# EAGLE board PX4FMUv1.7.1 (EAGLE 6.4)
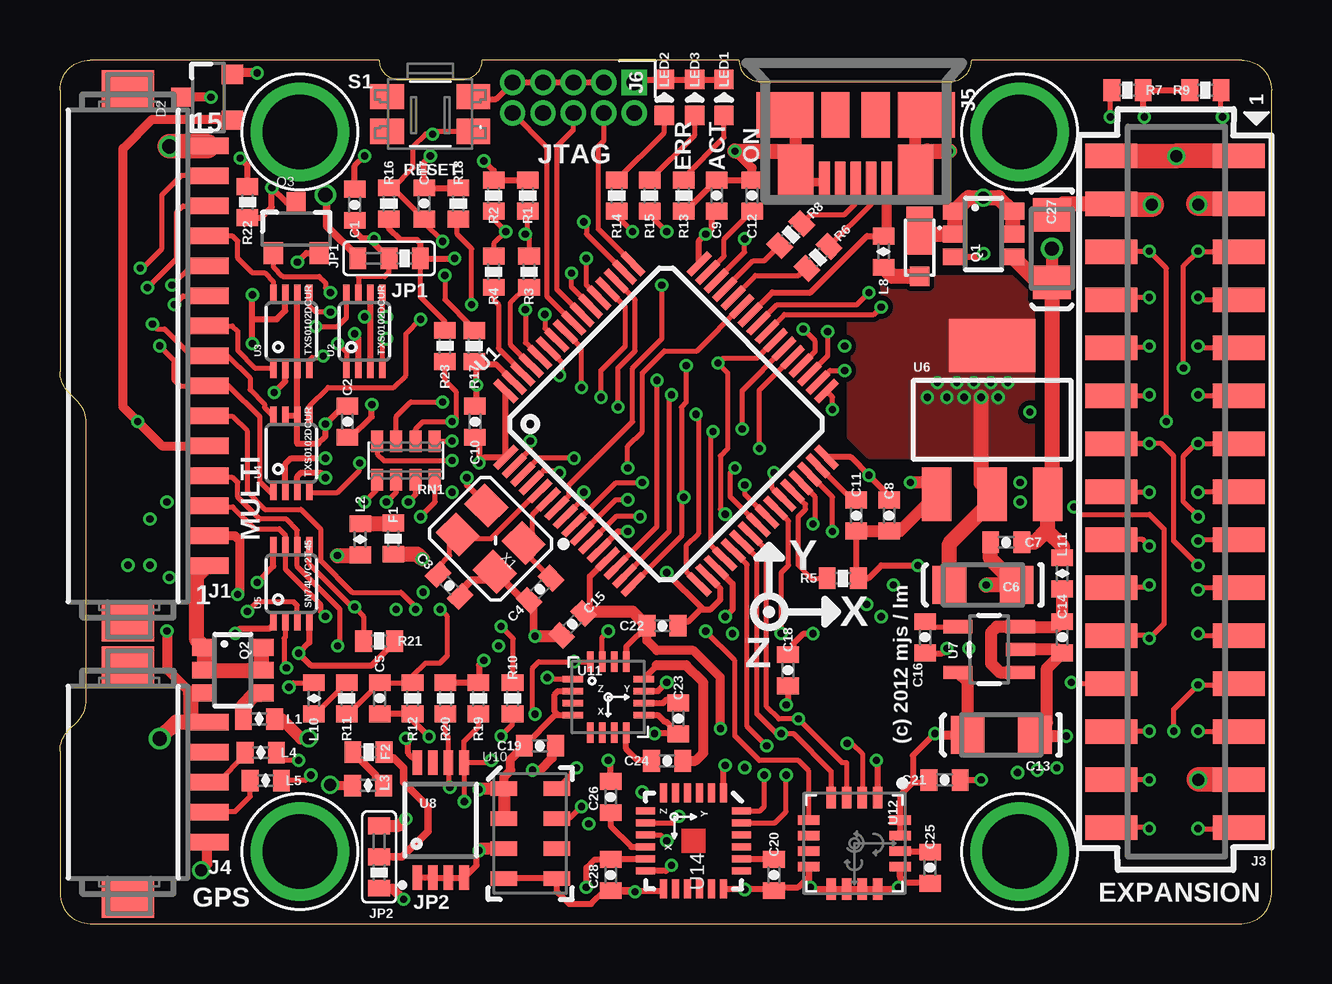
[diagram p3: board, top side]
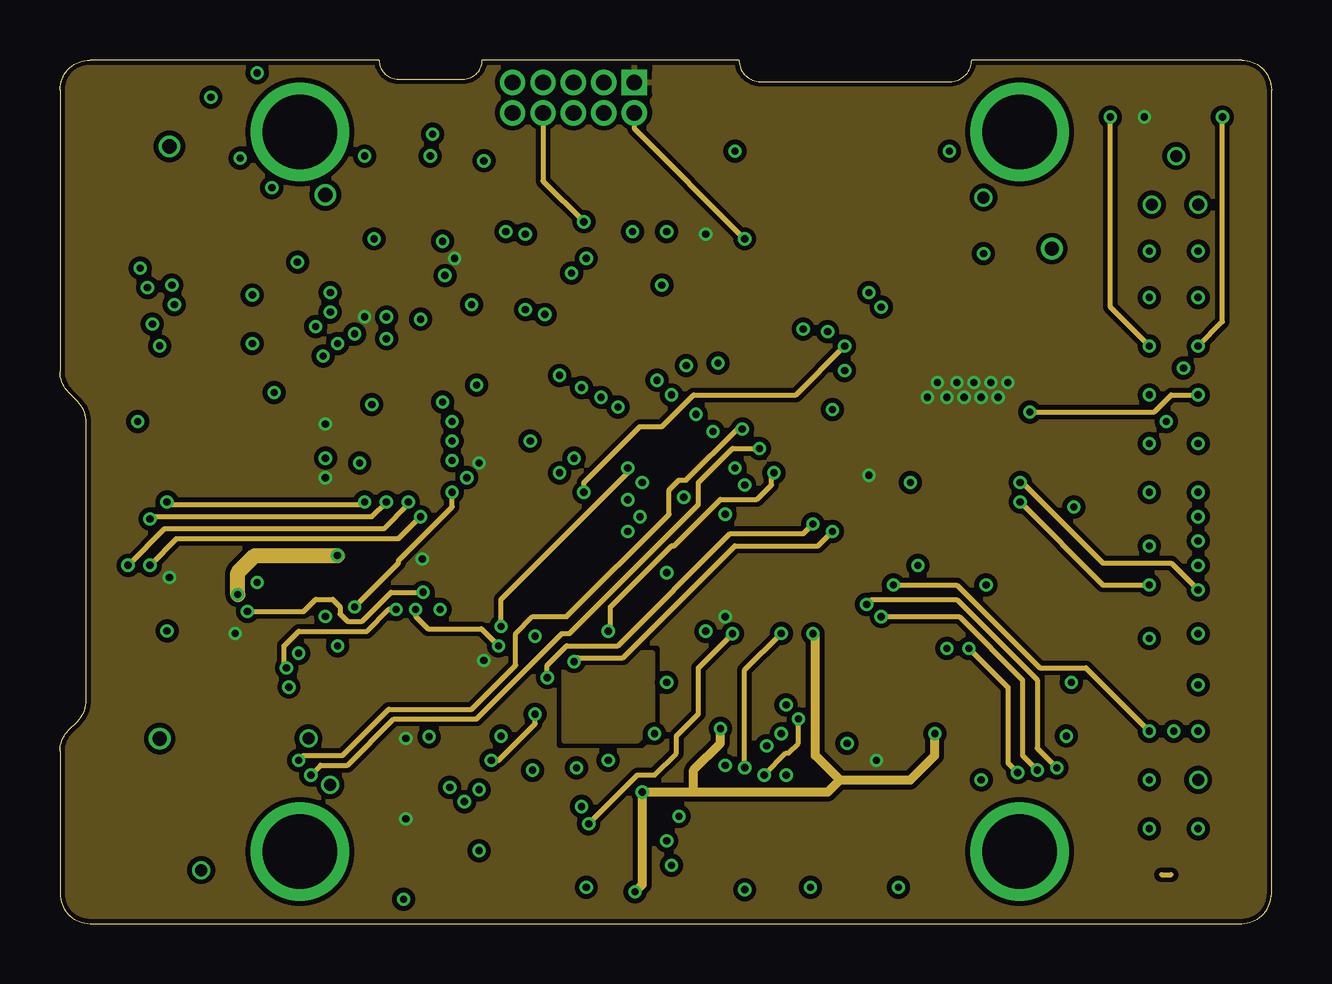
[diagram p4: board, inner layer Route2]
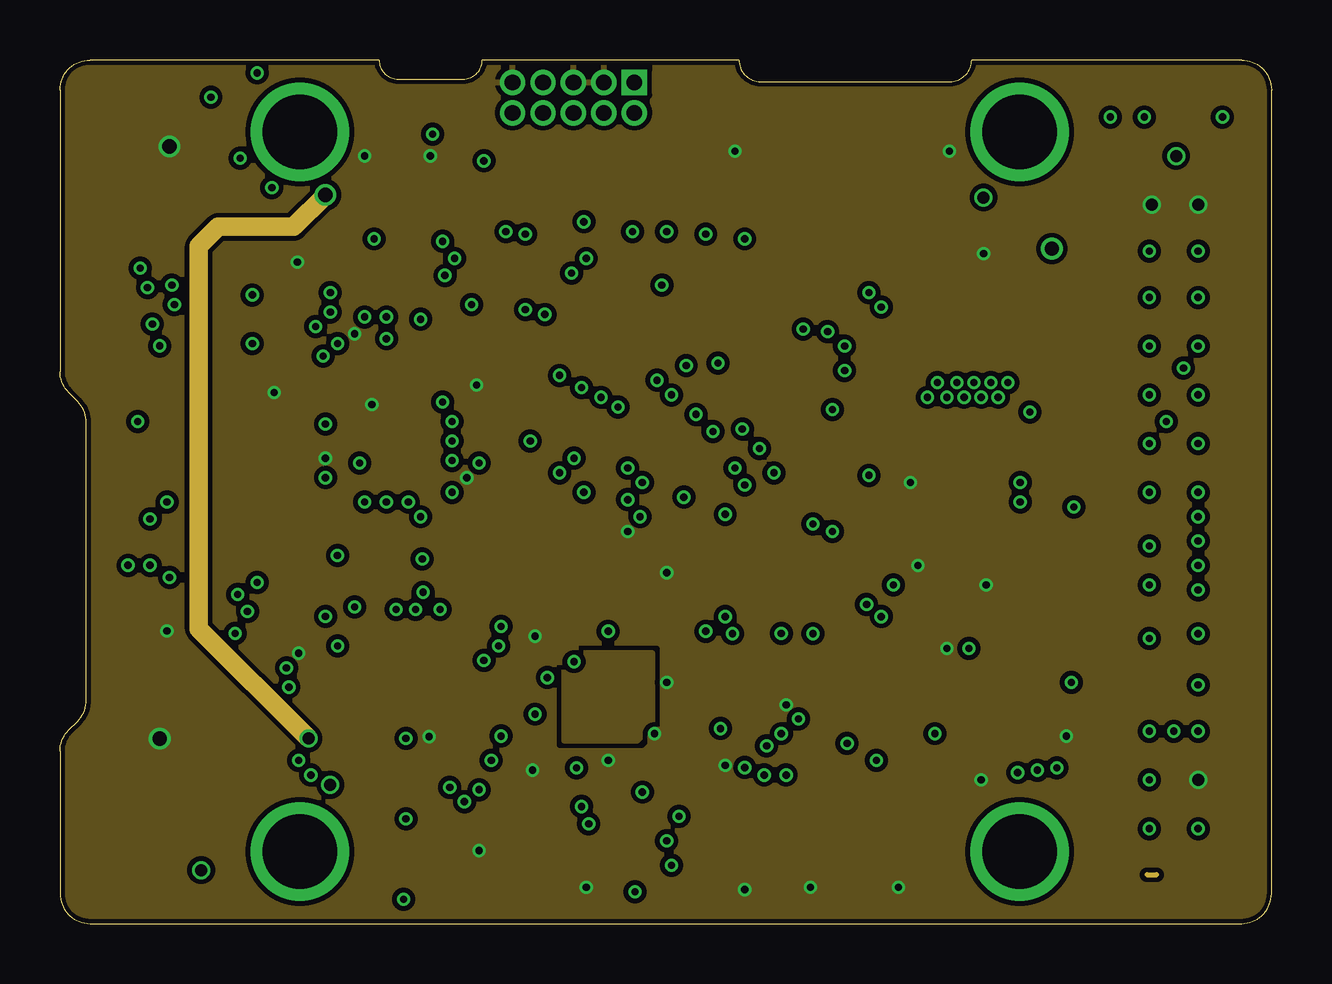
[diagram p5: board, inner layer Route15]
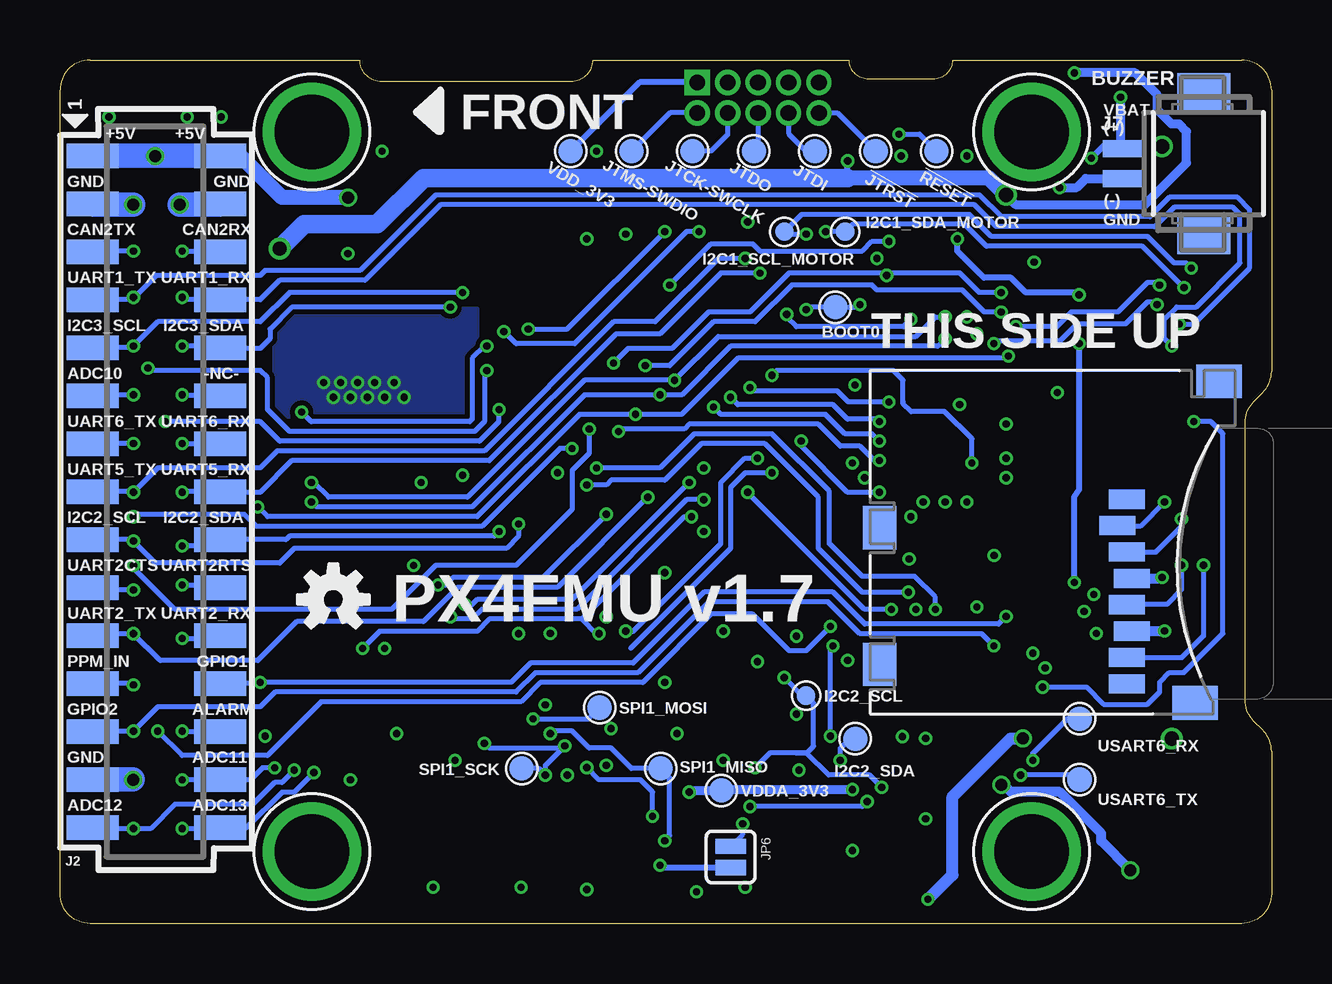
[diagram p6: board, bottom side, seen from below]

Size 50.5 x 36 mm. Coordinates in mm from the lower left corner, seen from the top.
Outline: 0,7.18 0,1.25 arc90 1.25,0 49.25,0 arc90 50.5,1.25 50.5,34.75 arc90 49.25,36 38,36 arc-90 37.1,35.1 29.2,35.1 arc-90 28.3,36 17.6,36 arc-90 16.8,35.2 14.1,35.2 arc-90 13.3,36 1.25,36 arc90 0,34.75 0,23.02 arc45 0.37,22.13 0.73,21.77 arc-45 1.1,20.88 1.1,9.32 arc-45 0.73,8.43 0.37,8.07 arc45 0,7.18
Copper layers (1*2*15*16): Top 0.035mm / dielectric 0.5mm / Route2 0.035mm / dielectric 0.5mm / Route15 0.035mm / dielectric 0.5mm / Bottom 0.035mm
Design rules "default": minimum track width 0.15mm, minimum drill 0.3mm, track to track 0.15mm, track to pad 0.15mm, pad to pad 0.15mm, via to via 0.15mm, smd to smd 0.15mm, copper to edge 0.2mm, drill to drill 0.2mm, minimum pad ring 0.125mm, minimum via ring 0.125mm, stop-mask expansion 1mil, vias tented up to drill 0.31mm, thermal gap 8mil
Net classes: 0 signal: width 0.203 mm, drill 0.3 mm, clearance 0.203 mm; 1 power: width 0.254 mm, drill 0.3 mm, clearance 0.203 mm

## Footprints (pad centres in the part's own frame; a part is rotated, then mirrored left to right if it is on the bottom)
PAD.04X.04 = smd 1.016 x 1.016: P$1 0,0
0402-CAP = smd 0.7 x 0.9: 1 -0.65,0; 2 0.65,0
EIA3216 = smd 1.4 x 1.6: A 1.4,0; C -1.4,0
MICROSMP = smd 0.8 x 0.8: ANODE 0.65,0 | smd 2 x 1.1: CATHODE -1.25,0
SOT23-3 = smd 0.8 x 0.9: 1 -0.95,-1; 2 0.95,-1; 3 0,1.1
0402-PTC = smd 0.7 x 0.9: 1 -0.65,0; 2 0.65,0
PAD.03X.03 = smd 0.762 x 0.762: P$1 0,0
DF13A-15P-1.25H = smd 0.7 x 1.8: 1 -8.75,-3.3; 2 -7.5,-3.3; 3 -6.25,-3.3; 4 -5,-3.3; 5 -3.75,-3.3; 6 -2.5,-3.3; 7 -1.25,-3.3; 8 0,-3.3; 9 1.25,-3.3; 10 2.5,-3.3; 11 3.75,-3.3; 12 5,-3.3; 13 6.25,-3.3; 14 7.5,-3.3; 15 8.75,-3.3 | smd 1.6 x 2.2: S1 11.1,0; S2 -11.1,0
HEADER_2MM_2X15_REVERSE = smd 1.02 x 2.16: 1 -14,-2.655; 2 -14,2.655; 3 -12,-2.655; 4 -12,2.655; 5 -10,-2.655; 6 -10,2.655; 7 -8,-2.655; 8 -8,2.655; 9 -6,-2.655; 10 -6,2.655; 11 -4,-2.655; 12 -4,2.655; 13 -2,-2.655; 14 -2,2.655; 15 0,-2.655; 16 0,2.655; 17 2,-2.655; 18 2,2.655; 19 4,-2.655; 20 4,2.655; 21 6,-2.655; 22 6,2.655; 23 8,-2.655; 24 8,2.655; 25 10,-2.655; 26 10,2.655; 27 12,-2.655; 28 12,2.655; 29 14,-2.655; 30 14,2.655
HEADER_2MM_2X15 = smd 1.02 x 2.16: 1 14,-2.655; 2 14,2.655; 3 12,-2.655; 4 12,2.655; 5 10,-2.655; 6 10,2.655; 7 8,-2.655; 8 8,2.655; 9 6,-2.655; 10 6,2.655; 11 4,-2.655; 12 4,2.655; 13 2,-2.655; 14 2,2.655; 15 0,-2.655; 16 0,2.655; 17 -2,-2.655; 18 -2,2.655; 19 -4,-2.655; 20 -4,2.655; 21 -6,-2.655; 22 -6,2.655; 23 -8,-2.655; 24 -8,2.655; 25 -10,-2.655; 26 -10,2.655; 27 -12,-2.655; 28 -12,2.655; 29 -14,-2.655; 30 -14,2.655
DF13A-5P-1.25H = smd 0.7 x 1.8: 1 -2.5,-3.3; 2 -1.25,-3.3; 3 0,-3.3; 4 1.25,-3.3; 5 2.5,-3.3 | smd 1.6 x 2.2: S1 4.85,0; S2 -4.85,0
MOLEX-47346-0001 = smd 1.7 x 0.44: D+ 2.8,0; D- 2.8,0.65; GND 2.8,-1.3; ID 2.8,-0.65; VBUS 2.8,1.3 | smd 1.9 x 2.375: GND1 0,2.95; GND4 0,-2.95 | smd 2.1 x 1.475: GND2 2.3,2.5; GND3 2.3,-2.5 | smd 1.9 x 1.175: GND5 0,-0.838; GND6 0,0.838
FTSH-105-01-XXX-DV = drill 0.65 pad 1.06 square: 1 0,0 | drill 0.65 pad 1.06: 2 0,1.27; 3 1.27,0; 4 1.27,1.27; 5 2.54,0; 6 2.54,1.27; 7 3.81,0; 8 3.81,1.27; 9 5.08,0; 10 5.08,1.27
DF13A-2P-1.25H = smd 0.7 x 1.8: 1 -0.605,-3.3; 2 0.645,-3.3 | smd 1.6 x 2.2: S1 2.995,0; S2 -2.955,0
SJ_3_0603_PASTE1&2 = smd 0.7 x 0.9: 1 -0.65,0; 2 0.65,0; 3 1.95,0
SJ_2 = smd 0.635 x 1.27: 1 -0.889,0; 2 0,0
0402-IND = smd 0.7 x 0.9: 1 -0.65,0; 2 0.65,0
LED-0603 = smd 0.8 x 0.8: A 0,-0.75; C 0,0.75
TSOP-6@1 = smd 0.7 x 1: 1 -0.95,-1.2; 2 0,-1.2; 3 0.95,-1.2; 4 0.95,1.2; 5 0,1.2; 6 -0.95,1.2
0402-RES = smd 0.7 x 0.9: 1 -0.65,0; 2 0.65,0
CTS742C083 = smd 0.5 x 0.9: 1 -1.2,-0.8; 2 -0.4,-0.8; 3 0.4,-0.8; 4 1.2,-0.8; 5 1.2,0.8; 6 0.4,0.8; 7 -0.4,0.8; 8 -1.2,0.8
EVQP7J01K = smd 1.4 x 1.05: A1 -1.8,0.725; A2 1.8,0.725; B3 -1.8,-0.725; B4 1.8,-0.725
TQFP64 = smd 1.2 x 0.29: 1 -5.7,3.75; 2 -5.7,3.25; 3 -5.7,2.75; 4 -5.7,2.25; 5 -5.7,1.75; 6 -5.7,1.25; 7 -5.7,0.75; 8 -5.7,0.25; 9 -5.7,-0.25; 10 -5.7,-0.75; 11 -5.7,-1.25; 12 -5.7,-1.75; 13 -5.7,-2.25; 14 -5.7,-2.75; 15 -5.7,-3.25; 16 -5.7,-3.75; 33 5.7,-3.75; 34 5.7,-3.25; 35 5.7,-2.75; 36 5.7,-2.25; 37 5.7,-1.75; 38 5.7,-1.25; 39 5.7,-0.75; 40 5.7,-0.25; 41 5.7,0.25; 42 5.7,0.75; 43 5.7,1.25; 44 5.7,1.75; 45 5.7,2.25; 46 5.7,2.75; 47 5.7,3.25; 48 5.7,3.75 | smd 0.29 x 1.2: 17 -3.75,-5.7; 18 -3.25,-5.7; 19 -2.75,-5.7; 20 -2.25,-5.7; 21 -1.75,-5.7; 22 -1.25,-5.7; 23 -0.75,-5.7; 24 -0.25,-5.7; 25 0.25,-5.7; 26 0.75,-5.7; 27 1.25,-5.7; 28 1.75,-5.7; 29 2.25,-5.7; 30 2.75,-5.7; 31 3.25,-5.7; 32 3.75,-5.7; 49 3.75,5.7; 50 3.25,5.7; 51 2.75,5.7; 52 2.25,5.7; 53 1.75,5.7; 54 1.25,5.7; 55 0.75,5.7; 56 0.25,5.7; 57 -0.25,5.7; 58 -0.75,5.7; 59 -1.25,5.7; 60 -1.75,5.7; 61 -2.25,5.7; 62 -2.75,5.7; 63 -3.25,5.7; 64 -3.75,5.7
TI-DCU = smd 0.27 x 0.8: 1 -0.75,-1.55; 2 -0.25,-1.55; 3 0.25,-1.55; 4 0.75,-1.55; 5 0.75,1.55; 6 0.25,1.55; 7 -0.25,1.55; 8 -0.75,1.55
SOT-223 = smd 1.219 x 2.235: 1 -2.311,-3.099; 2 0,-3.099; 3 2.311,-3.099 | smd 3.6 x 2.2: 4 0,3.099
SOT23-5 = smd 0.55 x 1.2: 1 -0.95,-1.3; 2 0,-1.3; 3 0.95,-1.3; 4 0.95,1.3; 5 -0.95,1.3
MSOP-8 = smd 0.4 x 1.02: 1 -0.975,-2.4; 2 -0.325,-2.4; 3 0.325,-2.4; 4 0.975,-2.4; 5 0.975,2.4; 6 0.325,2.4; 7 -0.325,2.4; 8 -0.975,2.4
MS5611-01BA = smd 1.1 x 0.6: 1 -1.1,1.875; 2 -1.1,0.625; 3 -1.1,-0.625; 4 -1.1,-1.875; 5 1.1,-1.875; 6 1.1,-0.625; 7 1.1,0.625; 8 1.1,1.875
HMC5883L-MAN = smd 0.85 x 0.285: 1 -1.475,0.75; 2 -1.475,0.25; 3 -1.475,-0.25; 4 -1.475,-0.75; 9 1.475,-0.75; 10 1.475,-0.25; 11 1.475,0.25; 12 1.475,0.75 | smd 0.285 x 0.85: 5 -0.75,-1.475; 6 -0.25,-1.475; 7 0.25,-1.475; 8 0.75,-1.475; 13 0.75,1.475; 14 0.25,1.475; 15 -0.25,1.475; 16 -0.75,1.475
L3G4200DH-MAN = smd 0.9 x 0.4: 1 -1.9,0.975; 2 -1.9,0.325; 3 -1.9,-0.325; 4 -1.9,-0.975; 9 1.9,-0.975; 10 1.9,-0.325; 11 1.9,0.325; 12 1.9,0.975 | smd 0.4 x 0.9: 5 -0.975,-1.9; 6 -0.325,-1.9; 7 0.325,-1.9; 8 0.975,-1.9; 13 0.975,1.9; 14 0.325,1.9; 15 -0.325,1.9; 16 -0.975,1.9
QFN-24 = smd 0.8 x 0.29: 1 -2,1.25; 2 -2,0.75; 3 -2,0.25; 4 -2,-0.25; 5 -2,-0.75; 6 -2,-1.25; 13 2,-1.25; 14 2,-0.75; 15 2,-0.25; 16 2,0.25; 17 2,0.75; 18 2,1.25 | smd 0.29 x 0.8: 7 -1.25,-2; 8 -0.75,-2; 9 -0.25,-2; 10 0.25,-2; 11 0.75,-2; 12 1.25,-2; 19 1.25,2; 20 0.75,2; 21 0.25,2; 22 -0.25,2; 23 -0.75,2; 24 -1.25,2
MOUNT-HOLE3.1 = drill 3.1 pad 4.1: P$1 0,0
MICROSD = smd 0.8 x 1.5: 1 -1.94,2.7; 2 -0.84,2.3; 3 0.26,2.7; 4 1.36,2.9; 5 2.46,2.7; 6 3.56,2.9; 7 4.66,2.7; 8 5.76,2.7 | smd 1.4 x 1.9: NC -6.85,6.55; NC3 6.55,5.55 | smd 1.8 x 1.4: NC1 -0.75,-7.6; NC2 4.95,-7.6
OSCILLATOR-3.2X2.5 = smd 1.4 x 1.2: 1 -1.1,-0.85; 2 1.1,-0.85; 3 1.1,0.85; 4 -1.1,0.85

## Placement (x,y rotation side)
!JTRST  PAD.04  [PAD.04X.04]  16.5,32.2 315 bottom
!RESET  PAD.04  [PAD.04X.04]  13.96,32.2 315 bottom
BOOT0  PAD.04  [PAD.04X.04]  18.18,25.7 0 bottom
C1  0u1  [0402-CAP]  12.29,29.96 90 top
C2  0u1  [0402-CAP]  11.98,20.92 270 top
C3  8p  [0402-CAP]  16.22,14.09 315 top
C4  8p  [0402-CAP]  20.01,13.93 45 top
C5  0u1  [0402-CAP]  13.33,9.39 270 top
C6  10u  [EIA3216]  38.47,14.11 180 top
C7  0u1  [0402-CAP]  39.44,15.89 180 top
C8  0u1  [0402-CAP]  34.56,17.01 270 top
C9  0u1  [0402-CAP]  27.37,30.34 90 top
C10  0u1  [0402-CAP]  17.3,20.92 90 top
C11  2u2  [0402-CAP]  33.19,17.01 270 top
C12  2u2  [0402-CAP]  28.85,30.34 90 top
C13  10u  [EIA3216]  39.23,7.87 180 top
C14  0u1  [0402-CAP]  41.77,11.93 270 top
C15  0u1  [0402-CAP]  21.36,12.47 225 top
C16  470p  [0402-CAP]  36.06,11.93 270 top
C17  0u1  [0402-CAP]  15.18,30.01 270 top
C18  0u1  [0402-CAP]  30.34,10.56 270 top
C19  0u1  [0402-CAP]  20.01,7.41 0 top
C20  0u01  [0402-CAP]  29.76,2.02 270 top
C21  0u1  [0402-CAP]  36.87,5.99 0 top
C22  0u1  [0402-CAP]  25.11,12.41 0 top
C23  4u7  [0402-CAP]  25.77,8.55 270 top
C24  0u22  [0402-CAP]  25.31,6.78 0 top
C25  0u01  [0402-CAP]  36.26,2.33 270 top
C26  2u2  [0402-CAP]  22.95,5.28 90 top
C27  10u  [EIA3216]  41.34,28.14 270 top
C28  2u2  [0402-CAP]  22.95,2.02 90 top
D1  MSS1P4-M3  [MICROSMP]  35.83,27.63 270 top
D2  BAT54C  [SOT23-3]  6.19,34.44 90 top
F1  500mA  [0402-PTC]  13.89,16.04 90 top
F2  200mA  [0402-PTC]  12.86,7.14 180 top
I2C1_SCL_MOTOR  PAD.03  [PAD.03X.03]  20.31,28.84 0 bottom
I2C1_SDA_MOTOR  PAD.03  [PAD.03X.03]  17.77,28.84 0 bottom
I2C2_SCL  PAD.03  [PAD.03X.03]  19.4,9.5 0 bottom
I2C2_SDA  PAD.04  [PAD.04X.04]  17.35,7.7 0 bottom
J1  DF13-15P-1.25H  [DF13A-15P-1.25H]  2.84,23.66 90 top
J2  HEADER_2X15-REV  [HEADER_2MM_2X15_REVERSE]  46.47,18.01 270 bottom
J3  HEADER_2X15  [HEADER_2MM_2X15]  46.47,18.01 90 top
J4  DF13-5P-1.25H  [DF13A-5P-1.25H]  2.84,5.89 90 top
J5  47346-0001  [MOLEX-47346-0001]  33.16,33.72 270 top
J6  ARM_MINI_JTAG-TH  [FTSH-105-01-XXX-DV]  23.94,35.07 180 top
J7  DF13-2P-1.25H  [DF13A-2P-1.25H]  2.83,31.7 270 bottom
JP1  0R  [SJ_3_0603_PASTE1&2]  14.37,27.73 180 top
JP2  0R  [SJ_3_0603_PASTE1&2]  13.3,2.13 90 top
JP6  JUMPER-2  [SJ_2]  22.55,2.33 270 bottom
JTCK-SWCLK  PAD.04  [PAD.04X.04]  24.13,32.2 315 bottom
JTDI  PAD.04  [PAD.04X.04]  19.04,32.2 315 bottom
JTDO  PAD.04  [PAD.04X.04]  21.58,32.2 315 bottom
JTMS-SWDIO  PAD.04  [PAD.04X.04]  26.67,32.2 315 bottom
L1  FERRITE  [0402-IND]  8.3,8.53 180 top
L2  FERRITE  [0402-IND]  12.51,16.02 270 top
L3  FERRITE  [0402-IND]  12.84,5.76 180 top
L4  BLM15HD102SN1  [0402-IND]  8.37,7.13 180 top
L5  BLM15HD102SN1  [0402-IND]  8.58,5.96 180 top
L8  FERRITE  [0402-IND]  34.33,28.01 90 top
L10  BLM15HD102SN1  [0402-IND]  10.58,9.39 90 top
L11  FERRITE  [0402-IND]  41.77,14.6 270 top
LED1  GREEN  [LED-0603]  27.68,34.43 180 top
LED2  AMBER  [LED-0603]  25.19,34.43 180 top
LED3  BLUE  [LED-0603]  26.46,34.43 180 top
Q1  NTGS4111P  [TSOP-6@1]  38.5,28.74 270 top
Q2  NTGS4111P  [TSOP-6@1]  7.21,10.56 270 top
Q3  ZXMS6004FFTA  [SOT23-3]  9.85,28.95 0 top
R1  1K5  [0402-RES]  19.5,30.34 90 top
R2  1K5  [0402-RES]  18.08,30.34 90 top
R3  100  [0402-RES]  19.55,27.17 90 top
R4  100  [0402-RES]  18.08,27.17 90 top
R5  10K  [0402-RES]  32.63,14.39 0 top
R6  22R  [0402-RES]  31.6,27.77 225 top
R7  1K5  [0402-RES]  44.49,34.74 0 top
R8  22R  [0402-RES]  30.46,28.72 225 top
R9  1K5  [0402-RES]  47.74,34.74 180 top
R10  1K0  [0402-RES]  18.86,9.39 270 top
R11  47K/0.1%  [0402-RES]  11.96,9.39 90 top
R12  10K/0.1%  [0402-RES]  14.7,9.39 90 top
R13  270R  [0402-RES]  26,30.34 90 top
R14  270R  [0402-RES]  23.21,30.34 90 top
R15  82R  [0402-RES]  24.58,30.34 90 top
R16  10K  [0402-RES]  13.71,30.01 270 top
R17  10K  [0402-RES]  17.26,24.07 90 top
R18  10K  [0402-RES]  16.6,30.01 270 top
R19  1K5  [0402-RES]  17.44,9.39 90 top
R20  1K5  [0402-RES]  16.07,9.39 90 top
R21  10K  [0402-RES]  13.3,11.78 180 top
R22  10K  [0402-RES]  7.82,30.07 90 top
R23  10K  [0402-RES]  16.04,24.08 90 top
RN1  CTS742C083  [CTS742C083]  14.42,19.3 180 top
S1  RESET  [EVQP7J01K]  15.44,33.75 180 top
SPI1_MISO  PAD.04  [PAD.04X.04]  25.47,6.46 315 bottom
SPI1_MOSI  PAD.04  [PAD.04X.04]  28.01,9 0 bottom
SPI1_SCK  PAD.04  [PAD.04X.04]  31.26,6.46 315 bottom
U1  STM32F405RGT6  [TQFP64]  25.27,20.82 45 top
U2  TXS0102DCUR  [TI-DCU]  12.69,24.68 0 top
U3  TXS0102DCUR  [TI-DCU]  9.64,24.68 0 top
U4  TXS0102DCUR  [TI-DCU]  9.64,19.6 0 top
U5  SN74LVC2T45  [TI-DCU]  9.64,14.17 0 top
U6  LD1117AS33  [SOT-223]  38.85,21 0 top
U7  MIC5207  [SOT23-5]  38.73,11.42 90 top
U8  128KBit EEPROM  [MSOP-8]  15.87,4.31 0 top
U10  MS5611-01BA  [MS5611-01BA]  19.6,3.75 0 top
U11  HMC5883L  [HMC5883L-MAN]  22.85,9.44 0 top
U12  L3GD20  [L3G4200DH-MAN]  33.11,3.34 270 top
U14  MPU-6000  [QFN-24]  26.41,3.45 270 top
U$1  MOUNT-HOLE3.1MM  [MOUNT-HOLE3.1]  40,3 0 top
U$2  MOUNT-HOLE3.1MM  [MOUNT-HOLE3.1]  10,33 0 top
U$3  MOUNT-HOLE3.1MM  [MOUNT-HOLE3.1]  10,3 0 top
U$4  MOUNT-HOLE3.1MM  [MOUNT-HOLE3.1]  40,33 0 top
U$5  SF-MICROSD  [MICROSD]  8.73,15.75 270 bottom
U$7  OSHW-LOGOS  [OSHW-LOGO-S]  39.11,13.5 0 bottom
USART6_RX  PAD.04  [PAD.04X.04]  8,8.54 0 bottom
USART6_TX  PAD.04  [PAD.04X.04]  8,6 0 bottom
VDD_3V3  PAD.04  [PAD.04X.04]  29.21,32.2 315 bottom
VDDA_3V3  PAD.04  [PAD.04X.04]  22.93,5.55 0 bottom
X1  24 MHz 3.2x2.5mm 8-10pf  [OSCILLATOR-3.2X2.5]  17.95,16.04 135 top

## Tracks (layer width: path | path; a pad name or v marks a point on that pad's centre or on a via)
!JTRST
  Top 0.203: U1.56 20.31,26.13 20.31,32.35 J6.10
  Bottom 0.203: !JTRST.P$1 18.1,33.8 J6.10
ACCEL_CS  (via drill 0.3)
  Top 0.203: U1.4 20.15,18.89 20.72,18.89 v20.82,18.79
  Bottom 0.203: v20.82,18.79 21.94,18.79 22.55,18.18 22.55,15.64 26.71,11.47
ADC123_IN10  (via drill 0.3)
  Top 0.203: v21.84,17.98 21.84,17.74 U1.8 | R11.1 12.03,8.74 C5.1 R12.2 14.72,10.06 14.72,10.36 15.23,10.86 15.84,10.86 16.15,11.17 16.15,12.79 v15.84,13.1 | J3.11 47.47,22.01 v47.44,22.04
  Route2 0.203: v21.84,17.98 21.84,18.38 24.17,20.72 25.09,20.72 26.41,22.04 30.68,22.04 v32.71,24.07 | v40.43,21.33 45.61,21.33 46.32,22.04 v47.44,22.04
  Bottom 0.203: v15.84,13.1 16.96,13.1 v21.84,17.98 | v47.44,22.04 49.1,22.04 J3.11 | v32.71,24.07 32.81,24.07 33.32,23.56 33.32,21.02 33.42,20.92 40.02,20.92 v40.43,21.33
ADC123_IN11  (via drill 0.3, 0.3 pad 0.51)
  Top 0.203: v24.27,18.38 23.18,18.38 U1.9 | J2.28 43.8,5.99 v45.41,5.99
  Route2 0.203: v33.62,13.3 33.83,13.51 37.38,13.51 40.73,10.15 40.73,7.31 v41.55,6.49
  Bottom 0.203: v24.27,18.38 29.15,13.51 33.11,13.51 33.32,13.3 v33.62,13.3 | 43.8,5.99 v45.41,5.99 | v41.55,6.49 42.05,6.49 42.56,5.99 43.8,5.99 | 43.8,5.99 J2.28
ADC123_IN12  (via drill 0.3, 0.3 pad 0.51)
  Top 0.203: v23.66,17.67 23.18,17.67 U1.10 | J2.29 49.08,3.95 v47.44,3.95
  Route2 0.203: v40.73,6.39 40.12,7 40.12,10.15 37.48,12.79 v34.23,12.79
  Bottom 0.203: v23.66,17.67 24.38,17.67 28.95,13.1 32.91,13.1 33.32,12.69 34.13,12.69 v34.23,12.79 | J2.29 49.08,3.95 v47.44,3.95 46.73,3.95 45.71,4.97 42.46,4.97 41.55,5.88 41.24,5.88 v40.73,6.39
ADC123_IN13  (via drill 0.3, 0.3 pad 0.51)
  Top 0.203: v24.17,16.96 23.17,16.96 U1.11 | J2.30 45.35,4.01 v45.41,3.95
  Route2 0.203: v37.89,11.47 39.51,9.85 39.51,6.7 v39.92,6.29 | v28.03,12.08 26.61,10.66 26.61,8.73 25.7,7.82 25.7,7.1 24.78,6.19 24.07,6.19 v22.04,4.16
  Bottom 0.203: v24.17,16.96 24.48,16.96 28.75,12.69 | 28.75,12.69 32.61,12.69 33.11,12.18 37.18,12.18 v37.89,11.47 | J2.30 43.77,3.95 | v45.41,3.95 43.87,3.95 J2.30 | J2.30 42.71,4.01 41.24,5.48 40.73,5.48 v39.92,6.29 | v28.03,12.08 28.14,12.08 28.75,12.69 | v22.04,4.16 22.04,3.73 JP6.1
ALARM  (via drill 0.3)
  Top 0.203: U1.39 29.81,24.32 29.05,23.56 27.63,23.56 v27.42,23.36 27.83,22.95 27.83,19.8 27.53,19.5 27.53,17.26 v27.73,17.06 | v45.41,8.02 J2.26 | R17.2 17.26,24.89 17.16,24.89 16.05,26.01 v16.05,27.02 | Q3.1 8.9,27.37 9.29,26.98 10.81,26.98 11.07,26.72 11.07,26.51 v11.27,26.31
  Route2 0.203: v34.74,14.11 37.38,14.11 40.84,10.66 42.77,10.66 v45.41,8.02
  Bottom 0.203: J2.26 45.4,8.01 v45.41,8.02 | v27.73,17.06 30.37,14.42 34.13,14.42 34.43,14.11 v34.74,14.11 | v27.42,23.36 26.81,23.97 24.99,23.97 23.46,25.49 21.73,25.49 20.11,27.12 16.05,27.12 | 16.05,27.12 13,27.12 12.18,26.31 v11.27,26.31 | 16.05,27.12 v16.05,27.02
BOOT0  (via drill 0.3)
  Top 0.203: v19.4,25.59 19.4,24.21 U1.60 | v17.16,25.8 17.16,28.14 16.55,28.75 16.55,29.31 R18.2
  Bottom 0.203: v19.4,25.59 19.3,25.7 BOOT0.P$1 17.26,25.7 v17.16,25.8
CAN2_RX  (via drill 0.3)
  Top 0.203: J2.6 45.38,28.01 v45.41,28.03 46.12,27.32 v46.12,20.92 | U1.33 32.2,21.95 v32.2,21.43
  Bottom 0.203: J2.6 43.84,28.03 v45.41,28.03 | v32.2,21.43 32.2,20.92 33.01,20.11 41.34,20.11 42.16,20.92 v46.12,20.92
CAN2_TX  (via drill 0.3)
  Top 0.203: J2.5 47.47,28.01 v47.44,28.03 46.83,27.42 v46.83,23.16 | v32.71,23.05 32.1,23.05 U1.34
  Bottom 0.203: J2.5 49.1,28.03 v47.44,28.03 | v46.83,23.16 46.73,23.05 42.16,23.05 41.85,22.75 41.85,21.43 40.94,20.52 33.22,20.52 32.81,20.92 32.81,22.95 v32.71,23.05
GND  (via drill 0.3, 0.5, 0.6)
  Top 0.254: C14.2 41.63,11.42 | C12.2 C9.2 26.1,29.73 26.03,29.73 | C5.2 R12.1 14.7,8.48 v15.38,7.79 | U8.1 U8.2 U8.3 U8.4 17.37,2.43 17.37,2.94 v17.47,3.04 | J6.3 J6.5 J6.9 18.17,34.37 17.34,34.37 S1.B3 | C11.2 33.19,14.48 R5.2 33.7,14.39 34.23,14.93 v35.76,14.93 | U1.18 27.53,13.96 27.53,13.51 27.12,13.1 26.81,13.1 | 41.14,8.37 C13.C 40.69,7.82 | v23.66,16.35 23.27,16.35 U1.12 | 30.78,32.2 30.68,32.2 30.66,32.19 J5.GND3 | v36.97,11.47 36.77,11.27 C16.2 | J2.4 43.86,29.96 | v47.44,29.96 47.44,30.01 | U6.1 36.06,18.38 | 26.03,29.73 25.9,29.73 | R13.1 26.03,29.73 | v47.44,5.99 47.46,6.01 | 25.76,7.92 25.25,8.43 25.19,8.43 24.92,8.69 U11.9 24.31,8.7 | 25.76,12.35 C22.2 25.95,12.6 26.2,12.6 26.7,13.1 26.81,13.1 | U5.4 10.39,11.71 v9.95,11.27 10.46,10.76 13,10.76 13.95,11.72 R21.1 | C27.C 41.82,30.01 | Q1.3 38.36,27.8 v38.5,27.93 | U3.2 9.39,22.6 v8.93,22.14 | U4.2 9.39,19.16 9.64,19.41 11.06,19.41 v11.07,19.4 | C10.2 17.37,21.5 v17.37,22.45 17.37,23.32 | 17.77,17.47 16.96,18.28 v16.96,18.59 | C2.2 12.14,20.27 13,21.12 v13,21.63 | U2.2 12.44,24.42 v12.29,24.58 | C1.2 12.29,31.59 v12.69,32 | R18.1 C17.1 15.18,31.74 v15.44,32 | 17.37,23.32 R17.1 | 17.37,23.32 18.17,23.32 U1.63 | U14.11 22.93,2.7 C28.2 22.28,2.67 21.94,2.33 v21.94,1.52 | 29.83,1.45 C20.2 | 29.83,1.45 29.9,1.52 30.78,1.52 31.21,1.95 U12.8 31.21,1.59 v31.29,1.52 31.36,1.45 U12.9 U12.10 U12.11 U12.12 34.87,1.45 v34.94,1.52 35.15,1.72 35.25,1.72 | 35.01,1.89 U12.13 35.01,1.95 35.25,1.72 | 35.25,1.72 36.22,1.72 C25.2 | C26.2 22.95,6.7 v22.85,6.8 | C21.2 v38.4,5.99 | U14.18 28.51,1.45 v28.54,1.41 28.57,1.45 29.83,1.45 | 26.81,13.1 v25.29,14.62 | U11.11 24.93,9.69 v25.29,10.05
  Top 0.254: 25.76,7.92 v24.78,7.92 | 25.76,7.92 C23.2 | v30.27,9.12 30.34,9.2 C18.2 30.54,10.11 | U14.1 27.66,6.53 v27.73,6.6 | Q3.2 10.27,27.95 v9.9,27.58
  Top 0.305: 19.73,13.27 19.73,12.05 v19.8,11.98 | 20.87,11.98 C15.2 | 19.73,13.27 19.52,13.27 X1.4 17.78,14.32 17.16,14.32 16.68,13.84 C3.2 | 19.73,13.27 19.73,13.29 C4.1 | X1.2 17.77,17.47
  Top 0.381: C16.2 36.2,11.42 | C19.2 20.52,7.27 20.52,6.9 20.01,6.39 v19.7,6.39 | J5.GND 31.16,30.93 J5.GND3 | 36.14,32.2 35.69,32.2 J5.GND2 | C12.2 28.85,31.5 28.64,31.7 v28.14,32.2
  Top 0.406: v4.46,12.19 4.46,10.59 5.44,9.61
  Top 0.508: 41.63,11.42 U7.2 | C11.2 C8.2 35,16.36 U6.1 | C14.2 41.14,10.64 41.14,8.37 | 40.69,7.82 v41.95,7.82 | 36.06,18.38 v35.45,18.38 | v19.8,11.98 20.87,11.98 | U10.3 17.55,3.13 v17.47,3.04 | J5.GND4 30.21,34.29 30.68,33.83 30.68,32.24 J5.GND3 | J5.GND1 36.11,34.4 35.65,33.93 35.65,32.24 J5.GND2
  Top 0.635: v28.14,32.2 30.68,32.2 | 36.14,32.2 v37.08,32.2 | C7.2 38.79,15.2 C6.C v38.6,14.11 | 41.82,30.01 J2.4 | Q2.3 5.44,9.61 5.44,8.47 5.48,8.43 | J4.5 4.84,8.39 v4.16,7.71
  Top 1.016: 43.86,29.96 v45.51,29.96 | 47.44,30.01 J2.3 | 47.46,6.01 J2.27 | J1.15 4.58,32.41 v4.56,32.4
  Bottom 0.254: 49.09,29.96 J2.3 | 43.86,29.96 J2.4 | v47.44,5.99 47.46,6.01 | v22.85,6.8 22.95,6.7
  Bottom 0.406: U$5.6 v4.47,12.19 v4.46,12.19
  Bottom 1.016: v47.44,29.96 49.09,29.96 | v45.51,29.96 43.86,29.96 | 47.46,6.01 J2.27
  pour Route15 (rank 2): -0.41,36.46 -0.41,-0.3 51.2,-0.3 51.2,36.46
GPIO1  (via drill 0.3)
  Top 0.203: U1.24 27.93,17.8 27.93,18.79 v28.14,18.99 | U5.2 9.39,11.94 9.34,11.89 9.34,10.76 v9.44,10.66
  Route2 0.203: v9.44,10.66 v9.44,10.67 9.34,10.77 9.34,11.57 9.95,12.18 12.79,12.18 13.71,13.1 v14.01,13.1
  Bottom 0.203: v28.14,18.99 25.49,18.99 24.07,20.41 20.82,20.41 18.43,18.03 18.43,15.84 17.06,14.47 14.88,14.47 14.01,13.61 v14.01,13.1
GPIO2  (via drill 0.3)
  Top 0.203: U1.25 28.54,17.9 v28.54,18.28 | U5.3 9.89,13.26 9.75,13.41 8.22,13.41 v7.82,13.01
  Route2 0.203: v15.13,13.81 13.8,13.81 12.59,12.6 11.98,12.6 11.68,12.9 11.68,13.21 11.37,13.51 10.66,13.51 10.15,13.01 v7.82,13.01
  Bottom 0.203: v28.54,18.28 v28.54,18.29 27.73,18.29 27.53,18.48 25.29,18.48 23.77,20.01 21.12,20.01 18.89,17.77 18.89,15.64 17.06,13.81 v15.13,13.81
GPIO_DIR  (via drill 0.3)
  Top 0.203: U1.2 19.6,19.75 v19.6,20.11 | U5.5 10.39,14.99 12.18,13.2 v12.29,13.2 12.65,12.79 R21.2
  Route2 0.203: v16.35,17.98 16.35,17.37 14.11,15.13 14.11,15.03 v12.29,13.2
  Bottom 0.203: v16.35,17.98 17.67,17.98 19.6,19.91 v19.6,20.11
GPIO_EXT1  (via drill 0.3)
  Top 0.203: v42.16,10.05 42.2,10.01 J2.24 | J1.3 6.18,17.37 7.21,17.37 8.13,16.45 9.14,16.45 9.39,16.19 U5.7 9.39,14.77 9.4,14.77 10.86,13.31 10.86,13.01 v11.07,12.8
  Bottom 0.203: J2.24 42.2,10.01 v42.16,10.05 42.15,10.06 31.69,10.06 30.89,10.86 26.61,10.86 23.66,13.82 18.28,13.82 16.95,12.49 11.38,12.49 v11.07,12.8
GPIO_EXT2  (via drill 0.3)
  Top 0.203: v47.44,8.02 47.45,8.01 J2.25 | v11.57,11.57 11.68,11.68 11.68,13.1 9.89,14.88 U5.6 9.89,16.4 9.44,16.86 8.33,16.86 7.41,17.78 7.41,18.39 7.21,18.59 6.21,18.59 J1.4
  Bottom 0.203: J2.25 49.12,8.02 v47.44,8.02 46.42,9.03 42.16,9.03 41.54,9.65 31.49,9.65 30.68,10.46 26.41,10.46 23.45,13.41 18.48,13.41 17.15,12.08 12.08,12.08 v11.57,11.57
GYRO_CS  (via drill 0.3)
  Top 0.203: U1.3 19.95,19.4 v21.43,19.4 | v26.92,12.18 28.14,10.96 28.14,7.82 29.15,6.8 30.78,6.8 31.21,6.36 U12.5
  Bottom 0.203: v21.43,19.4 21.94,19.4 22.95,18.38 22.95,15.84 26.61,12.18 v26.92,12.18
I2C1_SCL
  Top 0.203: U1.61 18.79,24.11 18.79,25.9 19.41,26.52 R3.1
I2C1_SCL_EXT  (via drill 0.3)
  Top 0.203: R3.2 19.55,28.59 v19.4,28.75 19.5,28.85 R1.1 | J1.14 6.11,31.19 5.07,31.19 4.26,30.38 4.26,28.14 3.45,27.33 3.35,27.33 v3.35,27.32
  Bottom 0.203: v19.4,28.75 20.22,28.75 I2C1_SCL_MOTOR.P$1 19.59,29.56 12.59,29.56 11.68,28.64 5.17,28.64 4.06,27.53 3.56,27.53 v3.35,27.32
I2C1_SDA
  Top 0.203: U1.62 19.29,22.96 18.28,23.97 18.28,25.8 18.08,26 R4.1
I2C1_SDA_EXT  (via drill 0.3)
  Top 0.203: R4.2 18.08,28.34 v18.59,28.85 18.08,29.35 R2.1 | J1.13 5.12,29.91 4.87,29.67 4.87,27.73 v3.65,26.51
  Bottom 0.203: v3.65,26.51 5.38,28.24 11.88,28.24 12.79,29.15 17.46,29.15 I2C1_SDA_MOTOR.P$1 18.57,28.84 v18.59,28.85
I2C2_SCL  (via drill 0.3)
  Top 0.203: 16.15,8.66 R20.1 16.07,7.89 16.19,7.77 U8.6 16.19,5.74 v16.25,5.68 | v31.39,16.65 31.49,16.76 31.49,17.78 U1.29 | J2.17 47.5,16.01 v47.44,15.94 | U11.1 20.38,10.19 v20.31,10.25
  Top 0.254: U10.8 20.77,5.63 21.33,6.19 21.33,6.29 v21.53,6.49
  Route2 0.203: v31.39,16.65 31.39,16.66 30.97,16.25 30.96,16.26 27.93,16.26 23.26,11.58 21.12,11.58 20.31,10.77 v20.31,10.25
  Bottom 0.203: J2.17 47.5,16.01 v47.44,15.94 46.52,15.03 41.34,15.03 40.73,15.64 31.89,15.64 31.39,16.15 v31.39,16.65 | v16.25,5.68 16.76,6.19 18.46,6.19 19.38,7.1 | 19.38,7.1 19.8,7.1 | v20.31,10.25 19.56,9.5 I2C2_SCL.P$1 19.09,9.19 19.09,7.39 19.38,7.1 | v21.53,6.49 20.91,7.11 19.39,7.11 19.38,7.1
I2C2_SDA  (via drill 0.3, 0.3 pad 0.51)
  Top 0.203: U1.30 32.2,17.77 v32.2,16.35 | v45.41,15.74 45.14,16.01 J2.18 | v19.8,8.73 19.7,8.83 19.7,10.66 19.96,10.92 v21.43,10.92 U11.16 | U8.5 17.89,6.71 v17.98,6.8 | U8.5 16.84,7.6 17.44,8.2 R19.1 | U10.7 21.23,4.38 v21.73,4.88 | v16.86,5.08 16.86,6.69 U8.5
  Route2 0.203: v17.98,6.8 18.28,6.8 19.8,8.32 v19.8,8.73 | v21.43,10.92 21.59,11.07 23.46,11.07 28.14,15.75 31.6,15.75 v32.2,16.35
  Bottom 0.203: v45.41,15.74 44.09,15.74 J2.18 41.08,16.01 40.94,16.15 32.4,16.15 v32.2,16.35 | I2C2_SDA.P$1 17.58,7.7 17.98,7.31 v17.98,6.8 | v21.73,4.88 17.06,4.88 v16.86,5.08
I2C3_SCL  (via drill 0.3)
  Top 0.203: v47.44,24.07 47.5,24.01 J2.9 | R9.1 48.39,33.68 v48.45,33.62 | U1.41 29.89,25.8 33.22,25.8 v33.72,26.31
  Route2 0.203: v48.45,33.62 48.45,25.09 v47.44,24.07
  Bottom 0.203: J2.9 47.5,24.01 v47.44,24.07 46.42,25.09 42.16,25.09 40.94,26.31 v33.72,26.31
I2C3_SDA  (via drill 0.3, 0.3 pad 0.51)
  Top 0.203: v45.41,24.07 45.34,24.01 J2.10 | R7.1 43.78,34.74 v43.78,33.62 | U1.40 30.19,25.39 33.93,25.39 v34.23,25.7
  Route2 0.203: v43.78,33.62 43.78,25.7 v45.41,24.07
  Bottom 0.203: v45.41,24.07 43.88,24.07 J2.10 43.78,23.97 42.16,23.97 41.75,24.38 41.75,24.78 40.84,25.7 v34.23,25.7
JTCK-SWCLK
  Top 0.203: U1.49 22.45,28.94 22.45,32.4 22.67,32.63 J6.4
  Bottom 0.203: JTCK-SWCLK.P$1 23.36,32.2 22.67,32.88 J6.4
JTDI  (via drill 0.3)
  Top 0.203: U1.50 21.94,28.74 21.94,29.15 v21.84,29.25
  Route2 0.203: v21.84,29.25 20.13,30.95 J6.8
  Bottom 0.203: JTDI.P$1 19.4,32.2 20.11,32.91 20.11,33.77 J6.8
JTDO
  Top 0.203: U1.55 20.72,26.43 20.72,32.4 21.4,33.09 J6.6
  Bottom 0.203: JTDO.P$1 21.4,32.37 J6.6
JTMS-SWDIO  (via drill 0.3)
  Top 0.203: U1.46 28.54,27.99 v28.54,28.54
  Route2 0.203: v28.54,28.54 23.94,33.14 J6.2
  Bottom 0.203: JTMS-SWDIO.P$1 25.07,33.8 J6.2
LED_AMBER  (via drill 0.3)
  Top 0.203: v23.87,28.85 23.21,29.51 R14.1 | U1.35 32,23.66 v32,24.68
  Bottom 0.203: v32,24.68 31.49,24.17 29.05,24.17 24.38,28.85 v23.87,28.85
LED_BLUE  (via drill 0.3)
  Top 0.203: v25.29,28.85 24.58,29.56 R15.1 | U1.36 31.49,23.86 31.49,24.27 v30.98,24.78
  Bottom 0.203: v30.98,24.78 29.35,24.78 v25.29,28.85
MAG_DRDY  (via drill 0.3)
  Top 0.203: v29.76,18.79 29.76,18.69 29.66,18.59 29.66,18.18 30.16,17.67 U1.27 | U11.15 22.6,11.93 v22.85,12.18
  Route2 0.203: v22.85,12.18 22.95,12.28 22.95,13.2 25.49,15.75 25.59,15.75 27.53,17.68 29.05,17.68 29.66,18.29 29.66,18.69 v29.76,18.79
MPU_CS  (via drill 0.3)
  Top 0.203: U14.8 25.52,4.2 v25.8,4.47 | v30.07,12.09 30.07,14.63 30.37,14.94 30.37,16.77 U1.26
  Route2 0.203: v28.54,6.5 28.54,10.57 v30.07,12.09
  Bottom 0.203: v25.8,4.47 25.8,5.49 26.31,5.99 28.03,5.99 v28.54,6.5
N$1
  Top 0.203: U1.6 20.32,17.67 19.7,17.06 19.7,16.24 X1.1 19.33,15.53 C4.2
N$2
  Top 0.203: U1.5 19.96,18.03 17.98,16.05 16.75,16.05 X1.3 16.25,15.9 16.25,15.33 15.77,14.85 C3.1
N$3  (via drill 0.3)
  Top 0.381: J1.2 7.3,16.16 7.51,15.95 7.51,13.82 v7.41,13.72
  Top 0.635: v11.57,15.34 12.49,15.34 L2.2
  Route2 0.635: v7.41,13.72 7.41,14.63 8.12,15.34 v11.57,15.34
N$4  (via drill 0.3)
  Top 0.254: R22.2 7.82,31.6 v7.51,31.9
  Top 0.381: v6.29,34.44 D2.3
  Bottom 0.254: 6.29,32.47 6.95,32.47 v7.51,31.9
  Bottom 0.381: v6.29,34.44 6.29,32.47 J7.1
N$5
  Top 0.305: F2.2 12.21,7.13 13.15,6.19 13.15,6.1 L3.1
N$8
  Top 0.203: L5.2 7.93,5.29 7.31,4.67 6.17,4.67 J4.2
N$9
  Top 0.203: U7.4 36.27,12.37 C16.1
N$10
  Top 0.254: U11.8 23.6,7.28 24.07,6.81 24.63,6.81 C24.1
N$11
  Top 0.203: J4.3 6.24,5.99 6.7,5.99 7.62,6.92 7.62,7.03 L4.2
N$12  (via drill 0.3)
  Top 0.203: J1.11 5.47,27.41 v4.67,26.61 | U2.8 11.94,25.26 11.57,24.89 10.67,24.89 v10.66,24.88
  Bottom 0.203: v4.67,26.61 4.78,26.72 5.17,26.72 6.4,25.49 8.32,25.49 8.32,25.5 8.94,24.88 v10.66,24.88
N$13  (via drill 0.3)
  Top 0.203: U2.1 11.94,23.81 v11.58,24.18 v11.57,24.18 | J1.10 5.13,26.16 v4.77,25.8
  Bottom 0.203: 8.83,24.28 8.12,24.99 6.09,24.99 5.17,25.91 4.88,25.91 v4.77,25.8 | 8.83,24.28 | 8.83,24.28 11.46,24.28 v11.57,24.18
N$14
  Top 0.635: L1.2 7.65,9.07 8.12,9.54 8.34,9.54 Q2.4
N$15
  Top 0.203: 8.89,26.34 U3.8 8.89,26.76 8.53,27.13 8.02,27.13 7.41,27.74 7.41,28.45 7.21,28.65 J1.12
N$16
  Top 0.203: U3.1 8.86,23.16 8.12,23.16 7.41,23.88 7.41,24.69 7.18,24.91 J1.9
N$17
  Top 0.254: U11.12 24.52,10.19 24.52,10.39 24.88,10.76
  Top 0.406: 24.88,10.76 26.1,10.76 26.81,10.05 26.81,7.11 26.48,6.78 C24.2
N$18
  Top 0.305: JP2.2 14.26,2.78 15.33,3.85 15.33,4.87 14.32,5.88 14.32,6.49 13.91,6.9 13.75,6.9 F2.1
N$20  (via drill 0.3)
  Top 0.203: J3.12 45.38,22.01 v45.41,22.04
  Bottom 0.203: v45.41,22.04 43.85,22.04 J3.12
N$21  (via drill 0.3)
  Top 0.203: v12.69,17.57 13.2,18.08 13.2,18.38 13.22,18.39 RN1.5
  Route2 0.203: v12.69,17.57 12.59,17.47 4.57,17.47 v4.46,17.58
  Bottom 0.203: v4.46,17.58 5.48,16.56 6.4,16.56 U$5.2
N$23
  Top 0.635: L8.1 34.71,26.98 D1.ANODE
N$24  (via drill 0.5)
  Top 0.381: L3.2 11.29,5.76 v11.27,5.78
  Top 0.406: J4.1 6.14,2.48 v5.88,2.23
  Bottom 0.406: v11.27,5.78 11.16,5.78 10.86,5.49 8.83,5.49 7.1,3.76 7.1,3.45 v5.88,2.23
N$25  (via drill 0.3)
  Top 0.254: R22.1 8.38,29.42 8.83,29.87 v8.83,30.68 9.47,30.05 Q3.3
  Bottom 0.381: v8.83,30.68 8.12,30.68 7.75,31.05 J7.2
N$26  (via drill 0.3)
  Top 0.203: v13.61,17.57 14.01,17.98 RN1.6
  Route2 0.203: v13.61,17.57 13,16.96 3.85,16.96 v3.75,16.87
  Bottom 0.203: U$5.3 4.82,15.49 3.75,16.56 v3.75,16.87
N$27
  Top 0.635: L2.1 13.87,16.67 F1.2
N$28
  Top 0.203: R15.2 26.46,32.88 LED3.C
N$29
  Top 0.203: R13.2 26,31.1 27.68,32.77 LED1.C
N$30
  Top 0.203: R14.2 25.19,32.98 LED2.C
N$31  (via drill 0.3)
  Top 0.203: v14.52,17.57 v14.52,17.58 14.83,17.88 RN1.7
  Route2 0.203: v14.52,17.57 14.52,17.47 13.51,16.45 4.35,16.45 v2.84,14.94
  Bottom 0.203: U$5.7 3.74,11.09 2.84,11.99 v2.84,14.94
N$32  (via drill 0.3)
  Top 0.203: v15.03,16.96 v15.03,16.97 15.64,17.58 15.64,18.48 RN1.8
  Route2 0.203: v15.03,16.96 14.11,16.05 4.86,16.05 v3.75,14.94
  Bottom 0.203: v3.75,14.94 3.75,13.92 4.36,13.31 6.01,13.31 U$5.5
N$34
  Top 0.254: U12.14 36.22,3.02 C25.1
N$35
  Top 0.203: L10.1 10.65,8.74 R11.2
N$36
  Top 0.254: U11.10 25.14,9.19 25.29,9.34 25.64,9.34 C23.1
N$40
  Top 0.254: U14.20 29.78,2.7 C20.1
N$41
  Top 0.635: J1.1 6.12,14.91 5.7,14.5 5.7,11.81 Q2.1 Q2.2 Q2.5 Q2.6
N$42
  Top 0.254: U14.10 23.81,3.2 22.95,4.06 C26.1
N$44  (via drill 0.3)
  Top 0.254: U14.12 25.26,2.2 v25.49,2.43
  Bottom 0.254: v25.49,2.43 25.39,2.33 JP6.2
N$100
  Top 0.254: 41.57,12.37 C14.1
  Top 0.508: C14.1 L11.2 | 41.57,12.37 U7.3 39.04,12.37 38.8,12.13 38.8,10.84 39.17,10.47 U7.1
OTG_DM
  Top 0.203: R6.1 33.81,29.99 J5.D-
OTG_DP
  Top 0.203: J5.D+ 33.16,30.02 32.71,29.56 31.3,29.56 R8.1
OTG_FS_DM
  Top 0.203: U1.44 28.99,27.02 30.78,27.02 31.07,27.31 R6.2
OTG_FS_DP
  Top 0.203: U1.45 28.89,27.63 29.35,27.63 29.99,28.26 R8.2
PB2-BOOT1
  Top 0.203: U1.28 31.08,17.48 31.08,17.26 30.78,16.96 30.78,14.93 31.31,14.39 R5.1
POLY1
  Route15 0.203: 45.31,2.03 45.71,2.03
  pour Route2 (rank 2): 21.02,11.28 24.68,11.28 24.68,8.23 24.07,7.62 21.02,7.62
POLY2
  Route2 0.203: 45.91,2.03 46.32,2.03
  pour Route15: 21.02,11.28 24.68,11.28 24.68,8.23 24.07,7.62 21.02,7.62
PPM_INPUT  (via drill 0.3)
  Top 0.203: v46.42,8.02 46.42,8.93 v47.44,9.95 49.07,9.95 J2.23 | v18.38,12.39 18.89,11.88 18.89,10.06 R10.1 | v23.66,18.99 23.66,19.91 24.27,20.52 24.27,22.95 25.19,23.87 26.55,23.87 U1.43
  Route2 0.203: v23.66,18.99 23.66,18.79 18.38,13.51 v18.38,12.39
  Bottom 0.203: v46.42,8.02 45.41,7 41.85,7 39.62,9.24 39.62,9.25 31.29,9.25 30.48,10.05 26.2,10.05 26.09,10.16 26.1,10.16 23.36,12.9 21.63,12.9 20.1,11.37 19.4,11.37 v18.38,12.39 | J2.23 47.5,10.01 v47.44,9.95
PPM_INPUT_CON  (via drill 0.3)
  Top 0.203: v14.83,13.1 14.83,13.2 14.22,13.81 12.18,13.81 10.86,15.13 10.86,16.45 10.05,17.26 8.53,17.26 7.82,17.98 7.82,20.52 7.21,21.13 6.17,21.13 J1.6 | R10.2 18.86,8.3 v18.38,7.82
  Route2 0.203: v14.83,13.1 14.83,12.79 15.33,12.29 17.57,12.29 v18.28,11.57
  Bottom 0.203: v18.38,7.82 18.38,11.47 v18.28,11.57
RESET  (via drill 0.3)
  Top 0.203: U1.7 21.23,17.84 21.23,18.28 23.87,20.92 23.87,23.16 25.09,24.38 v25.09,26.61 | 17.22,33.01 S1.A1 15.65,33.02 v15.54,32.91 15.23,32.91 14.72,32.4 14.72,31.51 13.88,30.66 | 13.88,30.66 R16.1 | 13.88,30.66 C17.2 15.18,29.2 v15.94,28.44
  Bottom 0.203: v25.09,26.61 23.36,28.34 21.63,28.34 21.33,28.03 17.06,28.03 16.65,28.44 v15.94,28.44 | !RESET.P$1 14.67,32.91 v15.54,32.91
SPI1_MISO  (via drill 0.3)
  Top 0.203: U1.22 29.05,15.27 29.05,8.73 29.86,7.92 v30.07,7.92 30.57,7.92 32.14,6.35 U12.4 | U14.9 25.04,3.7 v25.29,3.45
  Bottom 0.203: v25.29,3.45 25.09,3.66 25.09,6.08 SPI1_MISO.P$1 26.68,6.46 26.68,6.47 27.53,7.32 28.44,7.32 29.15,8.03 29.96,8.03 v30.07,7.92
SPI1_MOSI  (via drill 0.3)
  Top 0.203: U1.23 29.46,15.57 29.46,9.03 29.96,8.53 v30.78,8.53 32.59,6.72 32.79,6.72 U12.3 | U14.24 29.17,4.7 29.35,4.88 v29.35,6.19
  Route2 0.203: v29.35,6.19 v29.35,6.2 30.27,7.11 30.37,7.11 30.78,7.52 v30.78,8.53
  Bottom 0.203: v30.78,8.53 28.48,8.53 SPI1_MOSI.P$1
SPI1_SCK  (via drill 0.3)
  Top 0.203: v29.46,7.41 28.64,8.22 28.64,14.97 U1.21 | v32.81,7.51 33.02,7.51 33.44,7.09 U12.2 | U14.23 29.8,4.2 30.27,4.67 v30.27,6.19
  Bottom 0.203: v29.46,7.41 | v32.81,7.51 32.61,7.31 29.56,7.31 v29.46,7.41 | v29.46,7.41 30.27,6.6 v30.27,6.19 30.54,6.46 SPI1_SCK.P$1
SPI3_MISO  (via drill 0.3)
  Top 0.203: v22.55,21.94 22.55,23.05 23.56,24.07 23.56,25.7 U1.52 | RN1.2 14.83,20.62 15.13,20.92 v16.35,20.92 16.43,20.92 16.53,21.02 16.53,22.15 16.05,22.63 R23.1 | RN1.2 14.83,20 | RN1.2
  Bottom 0.203: v16.35,20.92 16.45,21.02 17.67,21.02 18.28,21.63 22.24,21.63 v22.55,21.94
SPI3_MOSI  (via drill 0.3)
  Top 0.203: v21.73,22.34 21.73,24 U1.57 | RN1.3 14.01,21.13 14.62,21.74 v15.94,21.74
  Bottom 0.203: v21.73,22.34 21.59,22.2 18.1,22.2 17.64,21.74 v15.94,21.74
SPI3_NSS  (via drill 0.3)
  Top 0.203: U1.20 27.12,15.78 27.12,20.31 27.22,20.41 v27.22,20.52 | v16.35,19.3 13.51,19.3 13.22,19.58 RN1.4
  Bottom 0.203: v27.22,20.52 27.12,20.62 24.48,20.62 24.27,20.82 18.89,20.82 17.98,19.91 17.16,19.91 16.55,19.3 v16.35,19.3
SPI3_SCK  (via drill 0.3)
  Top 0.203: v23.26,21.53 23.26,23.16 23.97,23.87 23.97,26 U1.51 | v16.35,20.11 15.63,20.11 RN1.1
  Bottom 0.203: v16.35,20.11 16.65,20.41 17.77,20.41 18.59,21.23 22.95,21.23 v23.26,21.53
UART5_RX  (via drill 0.3, 0.3 pad 0.51)
  Top 0.203: v45.41,17.98 43.85,17.98 J2.16 | v21.33,27.12 21.33,26.52 U1.54
  Bottom 0.203: v45.41,17.98 45.37,18.01 J2.16 43.79,17.98 42.16,17.98 40.84,19.3 32.61,19.3 27.32,24.58 25.49,24.58 22.95,27.12 v21.33,27.12
UART5_TX  (via drill 0.3)
  Top 0.203: J2.15 47.47,18.01 v47.44,17.98 | v21.94,27.73 21.94,26.62 U1.53
  Bottom 0.203: J2.15 47.47,18.01 v47.44,17.98 46.42,18.99 42.16,18.99 41.45,19.7 32.81,19.7 27.42,25.09 25.7,25.09 23.05,27.73 v21.94,27.73
USART1_RX  (via drill 0.3)
  Top 0.203: v20.82,22.85 20.92,22.95 20.92,23.4 U1.59 | v12.49,19.19 12.49,18.89 11.57,17.98 10.47,17.98 U4.4
  Bottom 0.203: v20.82,22.85 20.62,23.05 15.84,23.05 15.77,23.05 15.36,22.65 15.36,21.74 15.36,21.67 15.03,21.34 13.61,21.34 13.61,21.33 12.49,20.21 v12.49,19.19
USART1_RX_EXT  (via drill 0.3)
  Top 0.203: J2.8 43.91,26.1 v45.41,26.1 | U4.1 8.79,17.95 8.32,18.42 8.32,21.13 7.04,22.41 J1.7 5,22.41 4.77,22.65 4.77,23.47 v4.16,24.08
  Bottom 0.203: v45.41,26.1 45.31,26.01 J2.8 42.15,26.01 41.34,26.81 37.79,26.81 34.64,29.96 12.38,29.96 11.47,29.06 4.88,29.06 4.87,29.05 4.06,29.86 1.61,29.86 1.31,29.57 1.31,27.53 3.14,25.7 3.95,25.7 4.46,25.2 4.46,24.38 v4.16,24.08
USART1_TX  (via drill 0.3)
  Top 0.203: U1.58 20.21,24.81 v20.21,25.39 | v15.03,25.19 14.42,24.58 14.42,22.85 13.91,22.34 11.17,22.34 10.39,21.57 U4.5
  Bottom 0.203: v20.21,25.39 20.21,25.29 19.8,24.88 15.33,24.88 v15.03,25.19
USART1_TX_EXT  (via drill 0.3)
  Top 0.203: J2.7 47.53,26.01 v47.44,26.1 | v3.85,24.99 4.05,24.79 4.36,24.79 5.49,23.66 J1.8 7.01,23.66 7.92,22.76 7.92,22.25 8.53,21.64 8.53,21.52 U4.8
  Bottom 0.203: J2.7 47.53,26.01 v47.44,26.1 47.41,26.1 46.49,27.02 42.16,27.02 41.95,27.22 37.99,27.22 34.84,30.37 12.18,30.37 11.27,29.46 5.07,29.46 4.26,30.28 1.41,30.28 0.91,29.77 0.91,27.33 3.24,24.99 v3.85,24.99 3.86,24.99
USART2_CTS  (via drill 0.3, 0.3 pad 0.51)
  Top 0.203: U1.14 24.88,16.55 v24.88,22.65 | J2.19 47.54,14.01 v47.44,13.91 | v13.61,25.29 13.44,25.45 U2.5
  Route2 0.203: v40.02,18.38 40.12,18.38 43.48,15.03 46.32,15.03 v47.44,13.91
  Bottom 0.203: v40.02,18.38 39.92,18.38 39.31,17.77 33.52,17.77 28.64,22.65 v24.88,22.65 23.05,24.48 14.83,24.48 14.01,25.29 v13.61,25.29 | v47.44,13.91 49.03,13.91 J2.19
USART2_RTS  (via drill 0.3, 0.3 pad 0.51)
  Top 0.203: v25.49,22.04 25.39,21.94 25.39,16.35 U1.15 | J2.20 45.31,14.01 45.31,14.02 v45.41,14.11 | v13.61,24.38 13.44,24.21 U2.4
  Route2 0.203: v40.02,17.57 43.48,14.11 v45.41,14.11
  Bottom 0.203: v40.02,17.57 39.82,17.37 33.32,17.37 28.64,22.04 v25.49,22.04 24.58,22.04 22.55,24.07 13.91,24.07 v13.61,24.38 | v45.41,14.11 43.92,14.11 J2.20
USART2_RX  (via drill 0.3, 0.3 pad 0.51)
  Top 0.203: v26.51,21.23 26.61,21.12 26.61,16.25 26.1,15.74 26.1,14.68 U1.17 | J2.22 45.28,12.01 v45.41,11.88 46.02,12.49 46.02,16.45 45.41,17.06 42.56,17.06 v42.26,17.37 | U3.4 10.39,23.49 10.5,23.6 10.91,23.6 v10.97,23.66
  Bottom 0.203: J2.22 43.95,11.88 v45.41,11.88 | v42.26,17.37 41.85,16.96 33.11,16.96 28.85,21.23 v26.51,21.23 24.59,21.23 22.24,23.57 11.05,23.57 v10.97,23.66
USART2_TX  (via drill 0.3)
  Top 0.203: v26.1,23.26 26.1,21.73 25.9,21.53 25.9,17.77 | U1.16 25.9,16.15 25.9,17.77 | J2.21 47.51,12.01 v47.44,12.08 | 25.9,17.77 v26,17.77 | U3.5 10.39,25.77 10.66,25.5 11.26,25.5 v11.27,25.49
  Bottom 0.203: J2.21 49.05,12.08 v47.44,12.08 46.32,10.96 42.26,10.96 40.63,12.59 35.35,12.59 33.93,14.01 29.76,14.01 v26,17.77 | v26.1,23.26 25.09,23.26 23.26,25.09 21.53,25.09 20,26.62 16.65,26.62 16.45,26.42 12.89,26.42 11.97,25.49 v11.27,25.49
USART6_RX  (via drill 0.3)
  Top 0.203: v28.44,20.62 28.44,22.23 U1.38 | v9.95,6.8 9.33,6.8 9.33,6.83 L4.1 | v45.41,20.01 J3.14 45.91,20.01 46.42,19.5 46.42,15.94 v47.44,14.93
  Route2 0.203: v28.44,20.62 28.24,20.62 26.1,18.48 25.8,18.48 25.39,18.08 25.39,17.06 21.12,12.79 19.7,12.79 18.99,12.08 18.99,10.76 17.16,8.93 13.71,8.93 11.78,7 10.15,7 v9.95,6.8
  Bottom 0.203: USART6_RX.P$1 8.51,8.54 9.95,7.1 v9.95,6.8 | J3.14 v45.41,20.01 | v47.44,14.93 47.44,14.83 45.71,13.1 36.67,13.1 34.84,14.93 31.49,14.93 29.15,17.26 29.15,18.89 28.44,19.6 v28.44,20.62
USART6_TX  (via drill 0.3)
  Top 0.203: U1.37 29.15,22.23 v29.15,19.8 | v10.46,6.19 10.23,5.96 L5.1 | v47.44,16.96 46.83,17.57 46.83,19.5 47.34,20.01 v47.44,20.01 J2.13
  Route2 0.203: v29.15,19.8 28.03,19.8 26.61,18.38 26.61,17.47 21.23,12.09 20.92,12.09 17.36,8.53 13.91,8.53 11.98,6.6 10.86,6.6 v10.46,6.19
  Bottom 0.203: 8.01,5.99 USART6_TX.P$1 8.19,6.19 v10.46,6.19 | v47.44,16.96 47.34,17.06 42.82,17.06 42.31,16.55 32.91,16.55 29.66,19.8 v29.15,19.8 | v47.44,20.01 J2.13
VBAT_IN  (via drill 0.3)
  Top 0.203: L10.2 9.73,10.04 v9.54,9.86
  Top 0.381: D2.1 7.22,33.53 3.85,33.53 2.63,32.31 2.63,21.54 v3.24,20.93 4.26,19.91 J1.5
  Bottom 0.203: v3.24,20.93 2.53,20.93 2.02,20.42 2.02,12.09 3.65,10.46 4.26,10.46 4.67,10.06 4.67,9.65 5.17,9.14 7,9.14 7.71,9.86 v9.54,9.86
VBUS
  Top 0.254: 34.46,28.79 L8.2 33.64,28.66 31.29,26.31 29.69,26.31 U1.42
  Top 0.406: 34.46,28.79 J5.VBUS
VCAP_1
  Top 0.203: 33.09,17.59 U1.31
  Top 0.254: 33.09,17.59 33.12,17.59 C11.1
VCAP_2
  Top 0.203: U1.47 27.68,27.83 27.68,28.53 C12.1
VDD_3V3  (via drill 0.3)
  Top 0.203: R23.2 16.05,25.09 15.03,26.11 15.03,27.72 JP1.1
  Top 0.254: LED1.A LED3.A LED2.A 24.06,35.18 J6.1 | U1.19 28.03,14.16 28.03,13.1 v27.73,12.79 | U1.48 26.64,28.47 v26.92,28.75 27.17,29 27.17,29.41 27.37,29.61 C9.1 | U1.32 32.97,19.44 v33.72,18.69 34.56,17.85 C8.1 | 16.07,10.18 R20.2 R19.2 17.47,10.06 17.47,10.77 v17.66,10.96 v17.67,10.96 | U6.4 38.8,24.15 | 38.8,17.57 38.8,17.85 U6.2 | R9.2 R7.2 45.14,33.68 v45.2,33.62 | U4.6 U4.7 | U2.3 12.94,25.29 | 12.94,25.29 U2.6 | U3.6 U3.3 U4.6 | U4.6 9.89,20.01 10.76,20.01 11.07,20.31 v11.07,20.82 11.82,21.57 C2.1 | U1.64 U1.1 17.71,19.44 v17.47,19.19 17.47,20.02 17.37,20.12 17.37,20.2 C10.1 | 12.94,25.29 v12.69,25.29 | v16.45,27.73 JP1.1 15.03,28.35 14.88,28.49 14.22,28.49 13.71,29 R16.2 | U8.8 14.91,6.71 14.52,7.1 14.52,7.61 v14.42,7.71 | U4.3 9.89,18.64 10.05,18.8 10.86,18.8 11.07,18.59 v11.07,18.59 | U5.1 8.89,12.46 8.73,12.29 7.51,12.29 v7.31,12.09 | U12.1 34.09,6.74 v34.03,6.8
  Top 0.508: JP2.3 14.13,4.08 v14.42,4.37
  Top 0.635: U6.2 38.4,18.36 v38.4,21.94 | C6.A 37.07,15.84 38.8,17.57 | F1.1 14.91,15.39 v15.1,15.2
  Bottom 0.254: VDD_3V3.P$1 26.34,35.07 J6.1
  Bottom 0.406: U$5.4 4.6,14.39 v4.56,14.43
  other vias: 38.8,22.55 39.51,22.55 39.11,21.94 38.09,22.55 37.69,21.94 37.38,22.55 36.97,21.94 36.16,21.94 36.57,22.55
  pour Route2 (rank 3): -0.41,36.46 -0.41,-0.3 51.2,-0.3 51.2,36.46
  pour Top (no thermals): 40.53,26.92 32.91,26.92 32.91,20.31 33.72,19.5 40.53,19.5
  pour Bottom: 33.11,20.62 33.11,25.6 41.55,25.6 41.55,20.62
VDD_3V3_ANALOG  (via drill 0.3)
  Top 0.254: U1.13 22.82,15.2 22.09,14.47 22.09,13.2 C15.1 21.89,12.93 21.96,13 | 20.62,8.84 20.62,9.55 20.76,9.69 U11.2 | 35.55,5.88 35.01,5.35 U12.16 U12.15 | 35.55,5.88 36.12,5.88 C21.1 | 35.55,5.88 35.55,7 v36.47,7.92 | 20.77,8.69 U11.4 | 20.77,8.69 20.62,8.84 | 20.62,8.84 20.62,8.83 | 20.77,8.69 20.64,8.69 C19.1 | 25.09,1.37 C28.1 22.7,1.37 22.14,0.81 21.23,0.81 20.7,1.34 U10.5 U10.4 | 25.09,1.37 25.13,1.37 | U14.13 25.09,1.37 | U11.13 23.6,11.55 C22.1 | v31.39,12.08 v31.39,12.07 30.96,12.07 30.57,11.68 30.57,11.44 C18.1 30.45,11.11
  Top 0.305: C28.1 23.97,1.37 v23.97,1.32
  Top 0.381: C13.A 36.52,7.87 v36.47,7.92 | C19.1 18.79,6.84 18.79,6.39 18.5,6.11 U10.1 | C22.1 24.46,11.8 24.88,11.38 26.41,11.38 27.53,10.26 v27.53,8.13
  Top 0.508: U7.5 37.84,10.06 C13.A | 21.96,13 23.88,13 C22.1 | v17.47,5.58 17.51,5.63 U10.1 U10.2
  Route2 0.381: 32.5,5.99 35.44,5.99 36.47,7.01 v36.47,7.92 | 32.5,5.99 31.49,7 31.49,11.98 v31.39,12.08 | 32.5,5.99 32,5.48 31.99,5.49 26.41,5.49 | v23.97,1.32 24.27,1.63 v24.27,5.48 24.28,5.49 26.41,5.49 | v27.53,8.13 27.53,7.52 26.41,6.4 26.41,5.49
  Bottom 0.305: v23.97,1.32 23.97,1.42
  Bottom 0.381: v17.47,5.59 22.89,5.59 VDDA_3V3.P$1 24.21,5.55 v24.27,5.48
  Bottom 0.508: v17.47,5.59 v17.47,5.58
VDD_5V  (via drill 0.3, 0.5, 0.6)
  Top 0.254: 41.16,16.45 41.16,16.36 | R1.2 R2.2 18.08,31.39 v17.67,31.79
  Top 0.305: v11.07,30.37 11.12,30.32 11.12,29.08 12.42,27.78 JP1.3
  Top 0.381: JP2.1 13.85,1.48 v14.32,1.01 | v8.22,35.46 7.26,35.46 D2.2
  Top 0.508: v41.34,28.14 41.34,27.12 | L1.1 9.24,8.53 10.05,7.71 v10.36,7.71
  Top 0.635: L11.1 41.77,15.76 41.16,16.36 | C7.1 40.61,15.89 41.16,16.45 U6.3 41.34,18.08 C27.A | Q1.4 40.76,26.73 C27.A | 41.34,27.12 C27.A
  Route15 0.762: v10.36,7.71 5.78,12.29 5.78,28.24 6.6,29.05 9.75,29.05 v11.07,30.37
  Bottom 0.254: 17.67,31.08 v17.67,31.79
  Bottom 0.381: v8.22,35.46 5.68,35.46 4.77,34.54 4.77,33.93 4.16,33.33 3.85,33.33 3.55,33.02 3.55,31.7 5.28,29.97 10.67,29.97 v11.07,30.37
  Bottom 0.508: v10.36,7.71 10.87,7.71 13.3,5.28 13.3,2.02 v14.32,1.01
  Bottom 0.635: v11.07,30.37 11.78,31.08 17.67,31.08
  Bottom 0.762: 17.67,31.08 35.35,31.08 37.28,29.15 40.33,29.15 v41.34,28.14
VDD_5V_IN  (via drill 0.5)
  Top 0.635: Q1.5 Q1.6 39.12,30.27 v38.5,30.27 37.87,30.27 Q1.1 Q1.2 35.96,28.75 D1.CATHODE
  Top 1.016: J2.2 43.83,32 v46.52,32 46.54,32.01 J2.1
  Bottom 0.635: 42.97,32 41.24,30.27 v38.5,30.27 | 42.97,32 v46.52,32 | J2.2 42.98,32.01 42.97,32
  Bottom 1.016: J2.2 J2.1
VDD_IO  (via drill 0.3)
  Top 0.203: U2.7 12.44,26.96 13.54,26.96 13.71,27.13 13.71,27.72 JP1.2
  Top 0.254: U5.8 8.89,14.9 v8.22,14.22 | U3.7 9.39,25.55 9.03,25.2 8.02,25.2 | v8.02,24.17 8.02,25.2 | 8.02,25.2 v8.02,26.2 | C1.1 12.29,28.85 12.59,28.55 v13.09,28.55 v13.1,28.54 13.1,28.35 JP1.2
  Bottom 0.254: v8.02,26.2 8.12,26.31 10.25,26.31 10.86,26.92 11.98,26.92 13.1,28.04 v13.1,28.54 | v8.02,24.17 8.02,18.09 8.22,17.78 v8.22,14.22

## Text on the board
tPlace: 15 | RESET | JTAG | ON | ERR | ACT | JP1 | MULTI | Y | 1 | X | Z | (c) 2012 mjs / lm | GPS | JP2 | EXPANSION
bPlace: BUZZER | VBAT | (+) | FRONT | +5V | +5V | GND | GND | (-) | GND | CAN2RX | CAN2TX | UART1_RX | UART1_TX | I2C3_SDA | I2C3_SCL | THIS SIDE UP | -NC- | ADC10 | UART6_RX | UART6_TX | UART5_RX | UART5_TX | I2C2_SDA | I2C2_SCL | UART2RTS | UART2CTS | PX4FMU v1.7 | UART2_RX | UART2_TX | GPIO1 | PPM_IN | ALARM | GPIO2 | ADC11 | GND | ADC13 | ADC12
tDocu: 5.0V | 5.0V | 3.3V | 3.3V